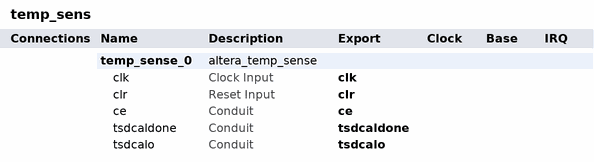
[diagram p0: system contents]
# Platform Designer (Qsys) system temp_sens, Arria V 5AGXMA3D4F27C5
# Parameters at their usual value, and those the tool derives, are not listed.
package require -exact qsys 15.1
create_system temp_sens
set_project_property DEVICE_FAMILY {Arria V}
set_project_property DEVICE 5AGXMA3D4F27C5

add_instance temp_sense_0 altera_temp_sense 15.1
set_instance_property temp_sense_0 AUTO_EXPORT true
set_instance_parameter_value temp_sense_0 CBX_AUTO_BLACKBOX ALL
set_instance_parameter_value temp_sense_0 CE_CHECK true
set_instance_parameter_value temp_sense_0 CLK_FREQUENCY 62.5
set_instance_parameter_value temp_sense_0 CLOCK_DIVIDER_VALUE 80
set_instance_parameter_value temp_sense_0 CLR_CHECK true
set_instance_parameter_value temp_sense_0 NUMBER_OF_SAMPLES 128
set_instance_parameter_value temp_sense_0 POI_CAL_TEMPERATURE 85
set_instance_parameter_value temp_sense_0 SIM_TSDCALO 0
set_instance_parameter_value temp_sense_0 USER_OFFSET_ENABLE off
set_instance_parameter_value temp_sense_0 USE_WYS on

# exported interfaces
add_interface ce conduit end
set_interface_property ce EXPORT_OF temp_sense_0.ce
add_interface clk clock sink
set_interface_property clk EXPORT_OF temp_sense_0.clk
add_interface clr reset sink
set_interface_property clr EXPORT_OF temp_sense_0.clr
add_interface tsdcaldone conduit end
set_interface_property tsdcaldone EXPORT_OF temp_sense_0.tsdcaldone
add_interface tsdcalo conduit end
set_interface_property tsdcalo EXPORT_OF temp_sense_0.tsdcalo

set_interconnect_requirement {$system} qsys_mm.clockCrossingAdapter HANDSHAKE
set_interconnect_requirement {$system} qsys_mm.enableEccProtection FALSE
set_interconnect_requirement {$system} qsys_mm.insertDefaultSlave FALSE
set_interconnect_requirement {$system} qsys_mm.maxAdditionalLatency 1

save_system temp_sens.qsys
